# EAGLE design lt308x_test_board-v0001 (EAGLE 6.4)
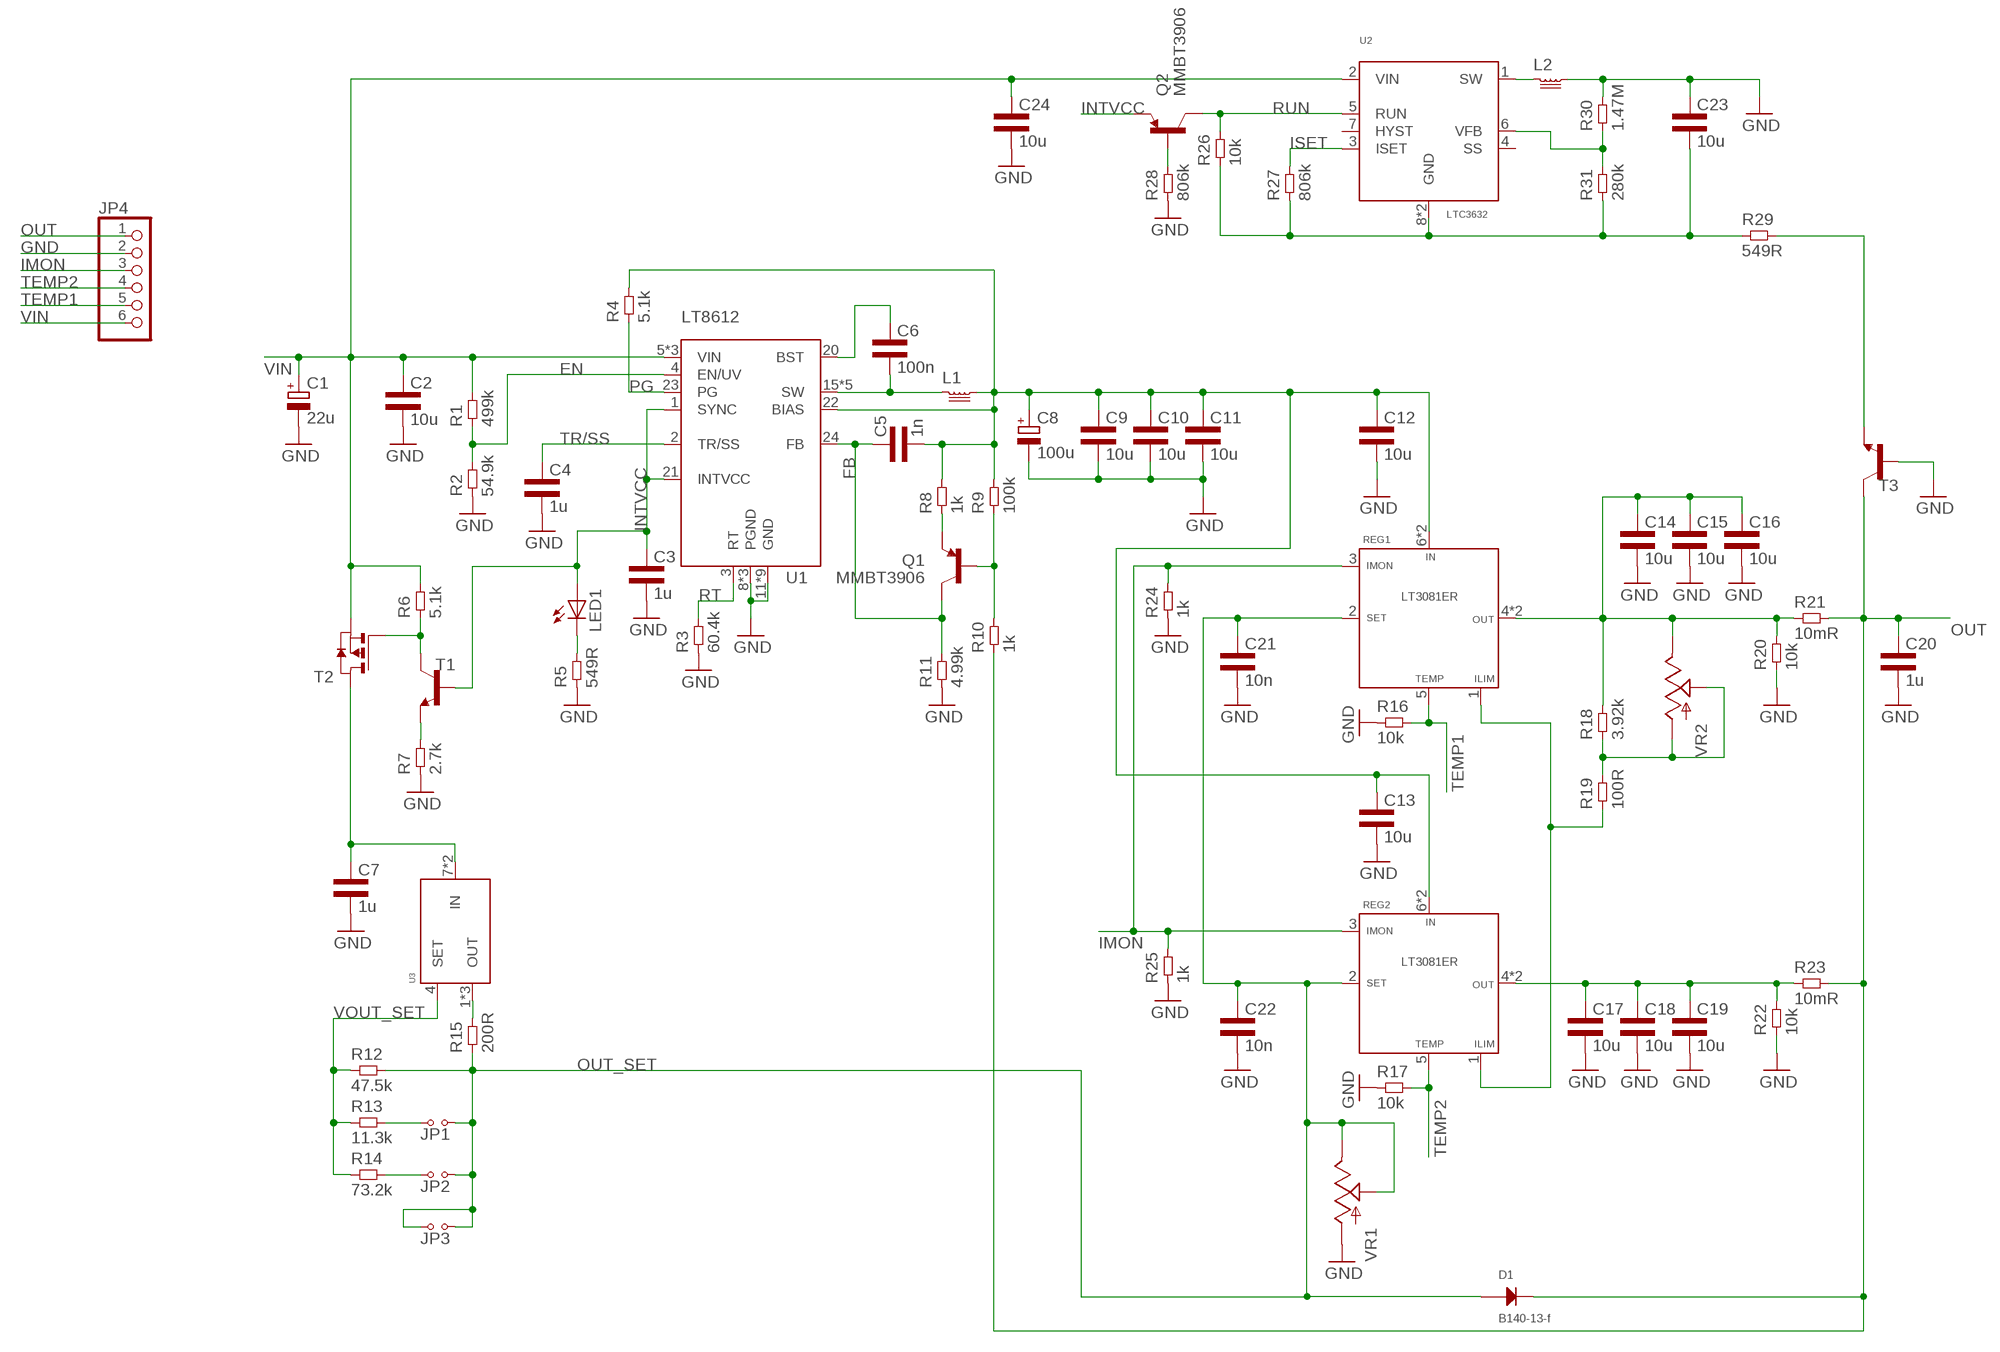
[diagram p0: schematic, sheet 1]

## Parts
C1  22u  CPOL-EUUD-6,3X7,7  [UD-6,3X7,7_NICHICON]
C2  10u  CAP1210L3  [1210L3]
C3  1u  CAP0603L3  [0603L3]
C4  1u  CAP0603L3  [0603L3]
C5  1n  CAP0603L3  [0603L3]
C6  100n  CAP0603L3  [0603L3]
C7  1u  CAP0805L3  [0805L3]
C8  100u  CPOL-EUUD-6,3X7,7  [UD-6,3X7,7_NICHICON]
C9  10u  CAP1210L3  [1210L3]
C10  10u  CAP1210L3  [1210L3]
C11  10u  CAP1210L3  [1210L3]
C12  10u  CAP1210L3  [1210L3]
C13  10u  CAP1210L3  [1210L3]
C14  10u  CAP1210L3  [1210L3]
C15  10u  CAP1210L3  [1210L3]
C16  10u  CAP1210L3  [1210L3]
C17  10u  CAP1210L3  [1210L3]
C18  10u  CAP1210L3  [1210L3]
C19  10u  CAP1210L3  [1210L3]
C20  1u  CAP1206L3  [1206L3]
C21  10n  CAP0603L3  [0603L3]
C22  10n  CAP0603L3  [0603L3]
C23  10u  CAP0805L3  [0805L3]
C24  10u  CAP0805L3  [0805L3]
D1  B140-13-f  DIODESMA  [SMA-2]
JP1  JUMPER2  [JUMPER2]
JP2  JUMPER2  [JUMPER2]
JP3  JUMPER2  [JUMPER2]
JP4  PINHD-1X6  [1X06]
L1  INDUCTOR10.5X10.5  [10.5X10.5]
L2  INDUCTOR1210L1  [1210L1]
LED1  LEDCHIPLED_0805  [CHIPLED_0805]
Q1  MMBT3906  TRANSISTOR_PNPMMBT3906  [SOT23]
Q2  MMBT3906  TRANSISTOR_PNPMMBT3906  [SOT23]
R1  499k  RES0603L3  [0603L3]
R2  54.9k  RES0603L3  [0603L3]
R3  60.4k  RES0603L3  [0603L3]
R4  5.1k  RES0603L3  [0603L3]
R5  549R  RES0603L3  [0603L3]
R6  5.1k  RES0603L3  [0603L3]
R7  2.7k  RES0603L3  [0603L3]
R8  1k  RES0603L3  [0603L3]
R9  100k  RES0603L3  [0603L3]
R10  1k  RES0603L3  [0603L3]
R11  4.99k  RES0603L3  [0603L3]
R12  47.5k  RES0603L3  [0603L3]
R13  11.3k  RES0603L3  [0603L3]
R14  73.2k  RES0603L3  [0603L3]
R15  200R  RES0805L3  [0805L3]
R16  10k  RES0603L3  [0603L3]
R17  10k  RES0603L3  [0603L3]
R18  3.92k  RES0603L3  [0603L3]
R19  100R  RES0603L3  [0603L3]
R20  10k  RES1210L3  [1210L3]
R21  10mR  RES1210L3  [1210L3]
R22  10k  RES1210L3  [1210L3]
R23  10mR  RES1210L3  [1210L3]
R24  1k  RES0603L3  [0603L3]
R25  1k  RES0603L3  [0603L3]
R26  10k  RES0603L3  [0603L3]
R27  806k  RES0603L3  [0603L3]
R28  806k  RES0603L3  [0603L3]
R29  549R  RES0603L3  [0603L3]
R30  1.47M  RES0603L3  [0603L3]
R31  280k  RES0603L3  [0603L3]
REG1  LT3081ER  [DPAK-7]
REG2  LT3081ER  [DPAK-7]
T1  TRANSISTOR_MMBT3904LT1-NPN-SOT23-BEC  [TRANSISTOR_SOT23-BEC]
T2  PMOSSOT23  [SOT-23]
T3  TRANSISTOR_MMBT3904LT1-NPN-SOT23-BEC  [TRANSISTOR_SOT23-BEC]
U1  LT8612  [UDE-3X6]
U2  LTC3632  [DFN-3X3]
U3  LT3092  [DD-8]
VR1  POT  [ALPS_POT]
VR2  POT  [ALPS_POT]

## Nets
-5V: C23.2 R26.P$1 R27.P$1 R29.P$1 R31.P$1 U2.8(GND) U2.TP(GND)
EN: R1.P$1 R2.P$2 U1.4(EN/UV)
FB: C5.P$1 Q1.3(C) R11.P$2 U1.24(FB)
FB_NEG: R30.P$1 R31.P$2 U2.6(VFB)
GND: C1.- C2.P$2 C3.P$2 C4.P$2 C7.2 C8.- C9.P$2 C10.P$2 C11.P$2 C12.P$2 C13.P$2 C14.P$2 C15.P$2 C16.P$2 C17.P$2 C18.P$2 C19.P$2 C20.2 C21.P$2 C22.P$2 C23.1 C24.2 JP4.2 L2.2 R2.P$1 R3.P$1 R5.P$1 R7.P$1 R11.P$1 R16.P$1 R17.P$1 R20.P$1 R22.P$1 R24.P$1 R25.P$1 R28.P$1 R30.P$2 T3.B U1.8(PGND) U1.9(PGND) U1.10(PGND) U1.11(GND) U1.12(GND) U1.13(GND) U1.14(GND) U1.25(GND) U1.26(GND) U1.27(GND) U1.28(GND) U1.TP(GND) VR1.P$3(A)
ILIM: R19.P$1 REG1.1(ILIM) REG2.1(ILIM)
IMON: JP4.3 R24.P$2 R25.P$2 REG1.3(IMON) REG2.3(IMON)
INTVCC: C3.P$1 LED1.A Q2.2(E) T1.B U1.1(SYNC) U1.21(INTVCC)
ISET: R27.P$2 U2.3(ISET)
LED: LED1.C R5.P$2
N$1: C7.1 T2.1(D) U3.7(IN) U3.8(IN)
N$2: R15.2 U3.1(OUT) U3.2(OUT) U3.9(OUT)
N$3: C6.P$1 U1.20(BST)
N$7: JP1.1 R13.P$2
N$8: JP2.1 R14.P$2
N$9: C5.P$2 C8.+ C9.P$1 C10.P$1 C11.P$1 C12.P$1 C13.P$1 L1.2 R4.P$2 R8.P$2 R9.P$2 REG1.6(IN) REG1.7(IN) REG2.6(IN) REG2.7(IN) U1.22(BIAS)
N$11: Q1.2(E) R8.P$1
N$12: R6.P$1 T1.C T2.3(G)
N$13: R7.P$2 T1.E
N$17: R18.P$1 R19.P$2 VR2.P$2(S) VR2.P$3(A)
N$18: C14.P$1 C15.P$1 C16.P$1 R18.P$2 R20.P$2 R21.P$1 REG1.4(OUT) REG1.TAB(OUT) VR2.P$1(E)
N$23: R29.P$2 T3.E
N$24: C17.P$1 C18.P$1 C19.P$1 R22.P$2 R23.P$1 REG2.4(OUT) REG2.TAB(OUT)
OUT: C20.1 D1.2(CATHODE) JP4.1 R10.P$1 R21.P$2 R23.P$2 T3.C
OUT_SET: C21.P$1 C22.P$1 D1.1(ANODE) JP1.2 JP2.2 JP3.1 JP3.2 R12.P$2 R15.1 REG1.2(SET) REG2.2(SET) VR1.P$1(E) VR1.P$2(S)
PG: R4.P$1 U1.23(PG)
Q1_GATE: Q1.1(B) R9.P$1 R10.P$2
Q2_GATE: Q2.1(B) R28.P$2
RT: R3.P$2 U1.3(RT)
RUN: Q2.3(C) R26.P$2 U2.5(RUN)
SW_BOOST: C6.P$2 L1.1 U1.15(SW) U1.16(SW) U1.17(SW) U1.18(SW) U1.19(SW)
SW_NEG: L2.1 U2.1(SW)
TEMP1: JP4.5 R16.P$2 REG1.5(TEMP)
TEMP2: JP4.4 R17.P$2 REG2.5(TEMP)
TR/SS: C4.P$1 U1.2(TR/SS)
VIN: C1.+ C2.P$1 C24.1 JP4.6 R1.P$2 R6.P$2 T2.2(S) U1.5(VIN) U1.6(VIN) U1.7(VIN) U2.2(VIN)
VOUT_SET: R12.P$1 R13.P$1 R14.P$1 U3.4(SET)
Unconnected: U2.4(SS) U2.7(HYST)

## Library data of the parts
C1 C8 = rcl:CPOL-EU: POLARIZED CAPACITOR, European symbol
C2-C7 C9-C24 = common:CAP
D1 = common:DIODE
JP1-JP3 = common:JUMPER2
JP4 = adafruit:PINHD-1X6: PIN HEADER
L1 L2 = common:INDUCTOR
LED1 = adafruit:LED: LED OSRAM: - CHIPLED LG R971, LG N971, LY N971, LG Q971, LY Q971, LO R971, LY R971 LH N974, LH R974 LS Q976, LO Q976, LY Q976 LO Q996 - Hyper CHIPLED LW Q18S LB Q993, LB Q99A, LB R99A - SideLED LS A670, LO A670, LY A670, LG A670, LP A670 LB A673, LV A673, LT A673, LW A673 LH A674 LY A675 LS A676, LA A676, LO A676, LY A676, LW A676 LS A679, LY A679, LG A679 - Hyper Micro SIDELED® LS Y876, LA Y876, LO Y876, LY Y876 LT Y87S - SmartLED LW L88C, LW L88S LB L89C, LB L89S, LG L890 LS L89K, LO L89K, LY L89K LS L896, LA L896, LO L896, LY L896 - TOPLED LS T670, LO T670, LY T670, LG T670, LP T670 LSG T670, LSP T670, LSY T670, LOP T670, LYG T670 LG T671, LOG T671, LSG T671 LB T673, LV T673, LT T673, LW T673 LH T674 LS T676, LA T676, LO T676, LY T676, LB T676, LH T676, LSB T676, LW T676 LB T67C, LV T67C, LT T67C, LS T67K, LO T67K, LY T67K, LW E67C LS E67B, LA E67B, LO E67B, LY E67B, LB E67C, LV E67C, LT E67C LW T67C LS T679, LY T679, LG T679 LS T770, LO T770, LY T770, LG T770, LP T770 LB T773, LV T773, LT T773, LW T773 LH T774 LS E675, LA E675, LY E675, LS T675 LS T776, LA T776, LO T776, LY T776, LB T776 LHGB T686 LT T68C, LB T68C - Hyper Mini TOPLED® LB M676 - Mini TOPLED Santana® LG M470 LS M47K, LO M47K, LY M47K Source: http://www.osram.convergy.de/
Q1 Q2 = SparkFun-DiscreteSemi:TRANSISTOR_PNP: Generic PNP BJT Double check pinouts against datasheets- not all devices are the same! MMBT3906 - 40V 200mA SOT-23 (TRANS-08052) MMBT4403 - 40V 600mA SOT-23 (TRANS-09245); PROD_ID: TRANS-08052
R1-R31 = common:RES
REG1 REG2 = common:LT3081ER
T1 T3 = logic:TRANSISTOR_*-NPN-: NPN Transistror BF959 corrected 2008.03.06
T2 = zetex:PMOSSOT23: MOS FET; OC_FARNELL: unknown; OC_NEWARK: unknown
U1 = common:LT8612
U2 = common:LTC3632
U3 = common:LT3092
VR1 VR2 = SparkFun-Electromechanical:POT

## Board
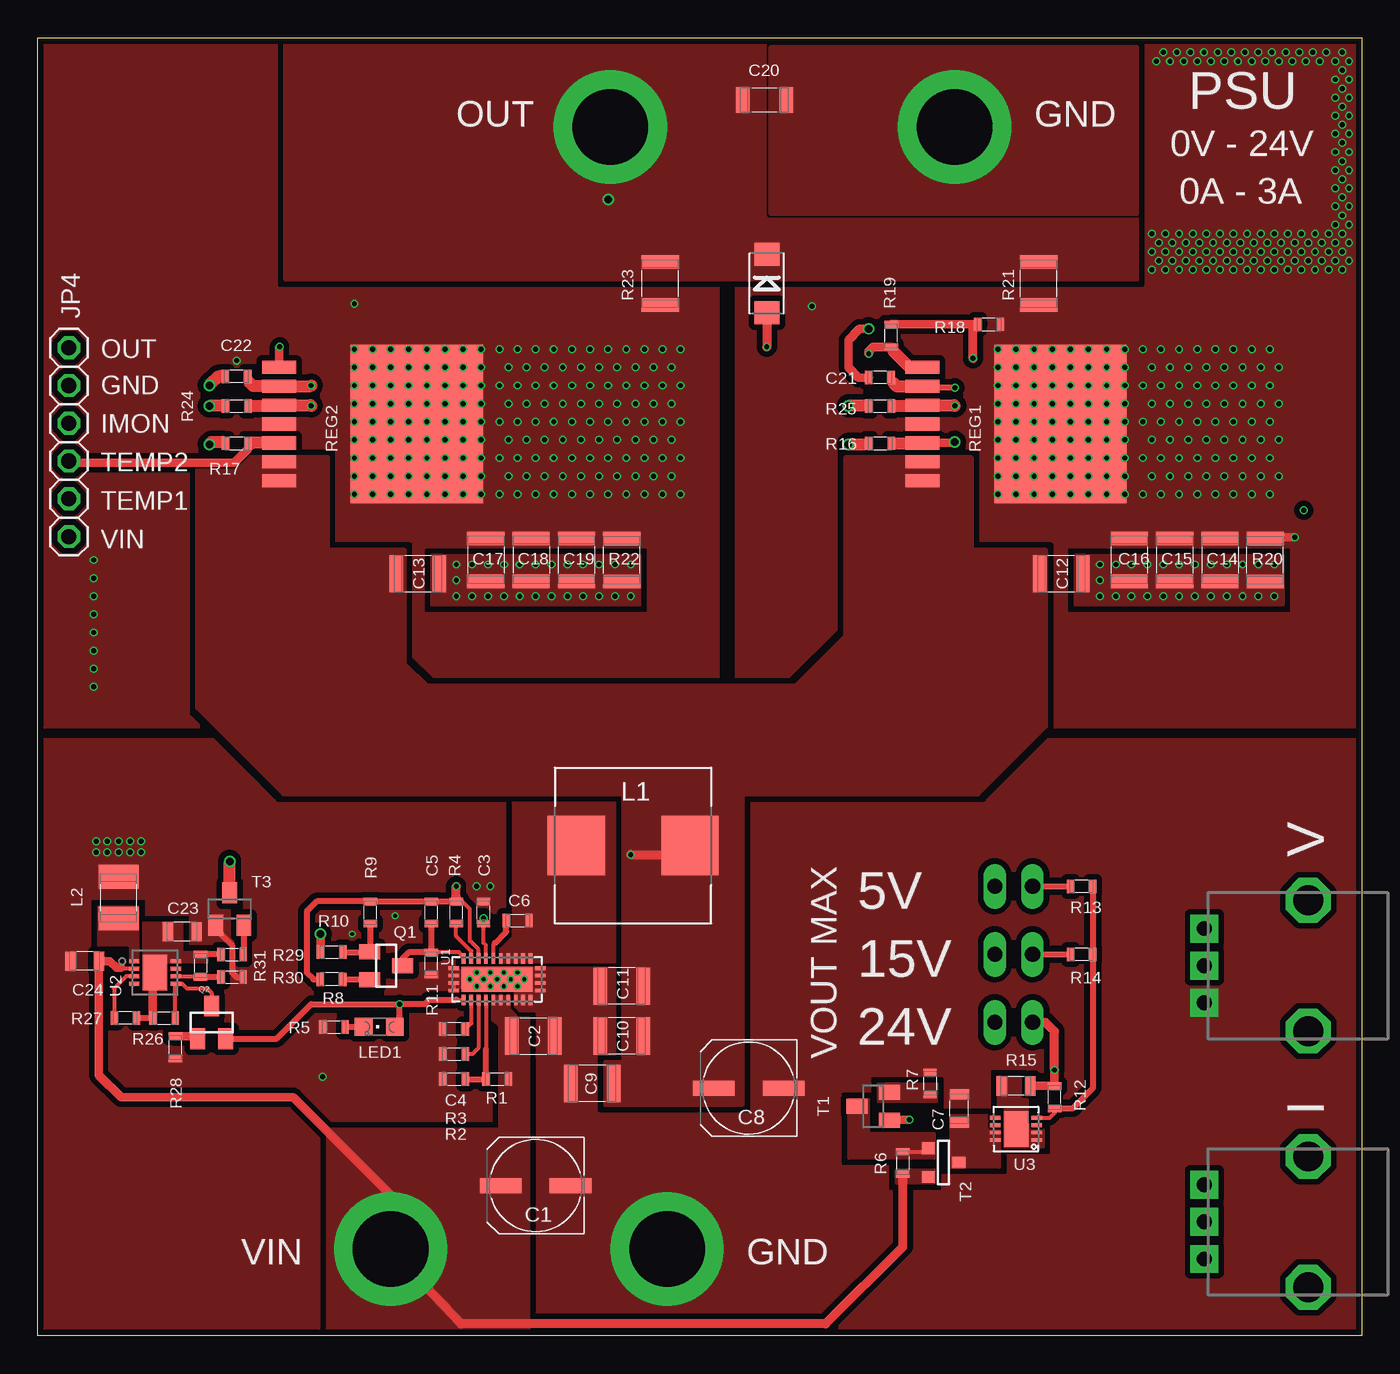
[diagram p1: board, top side]
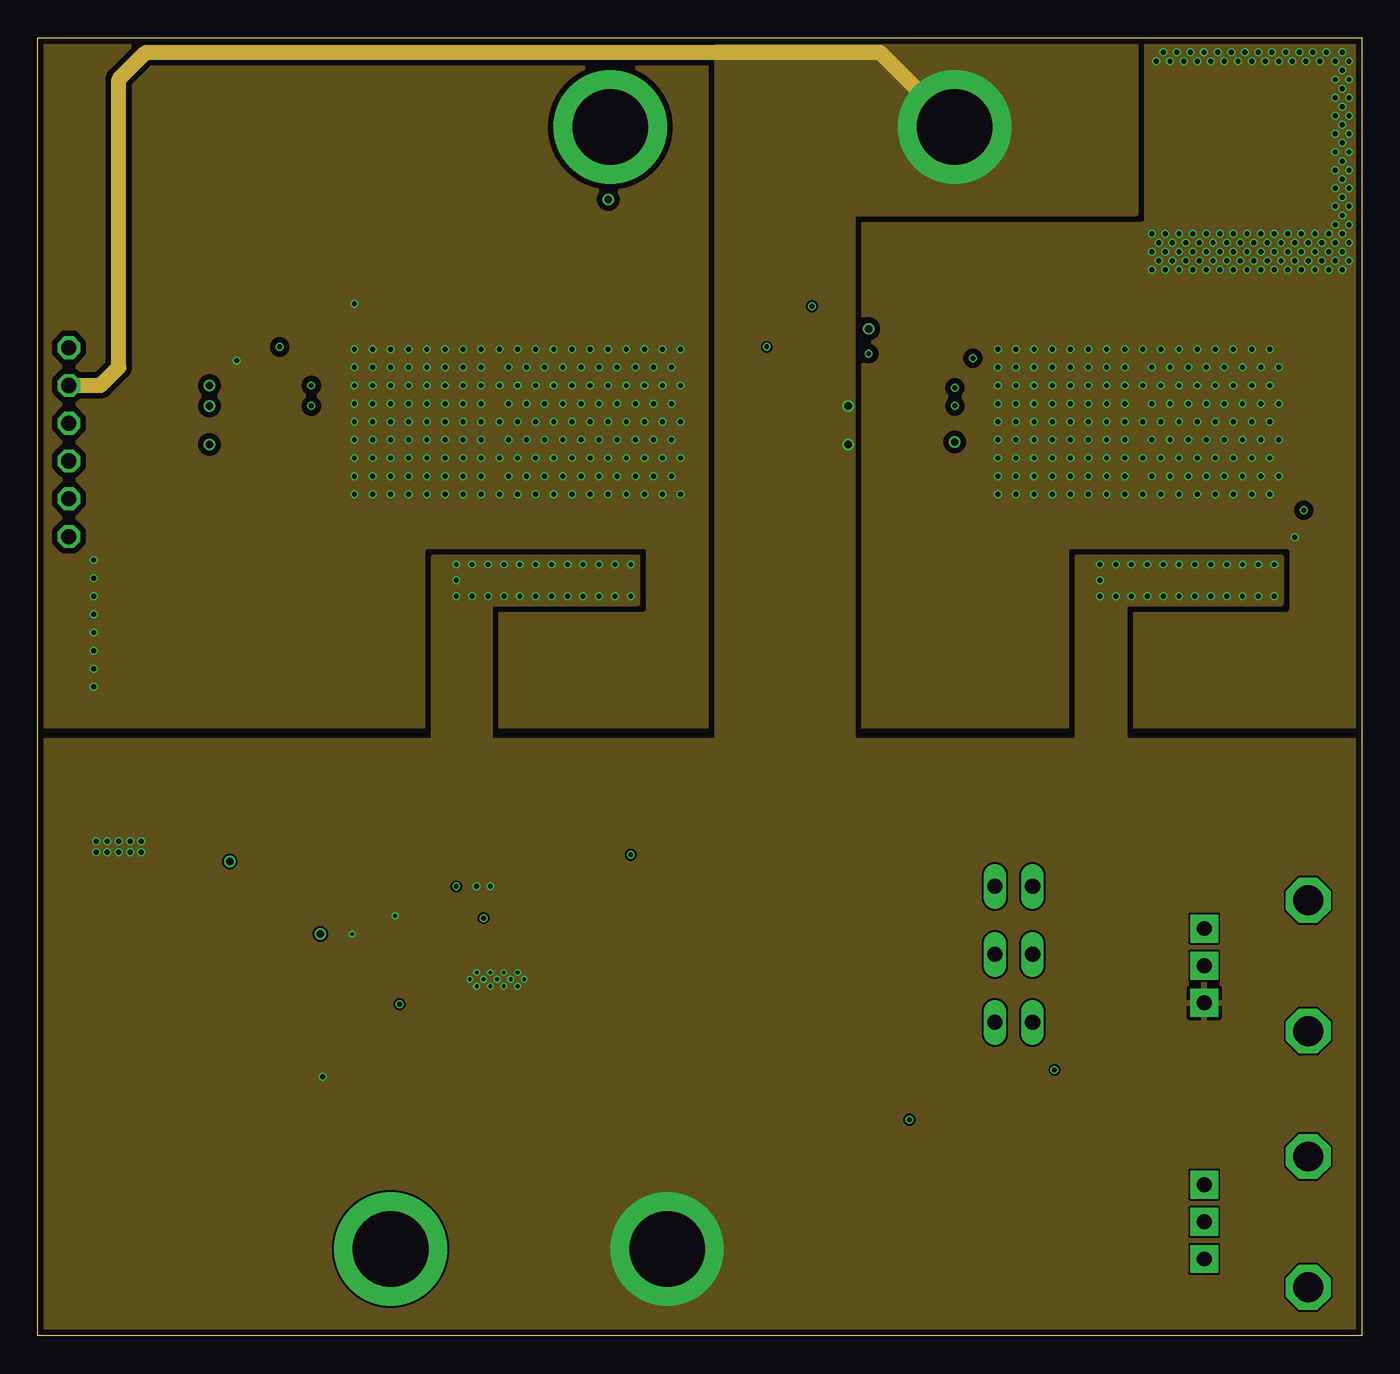
[diagram p2: board, inner layer Route2]
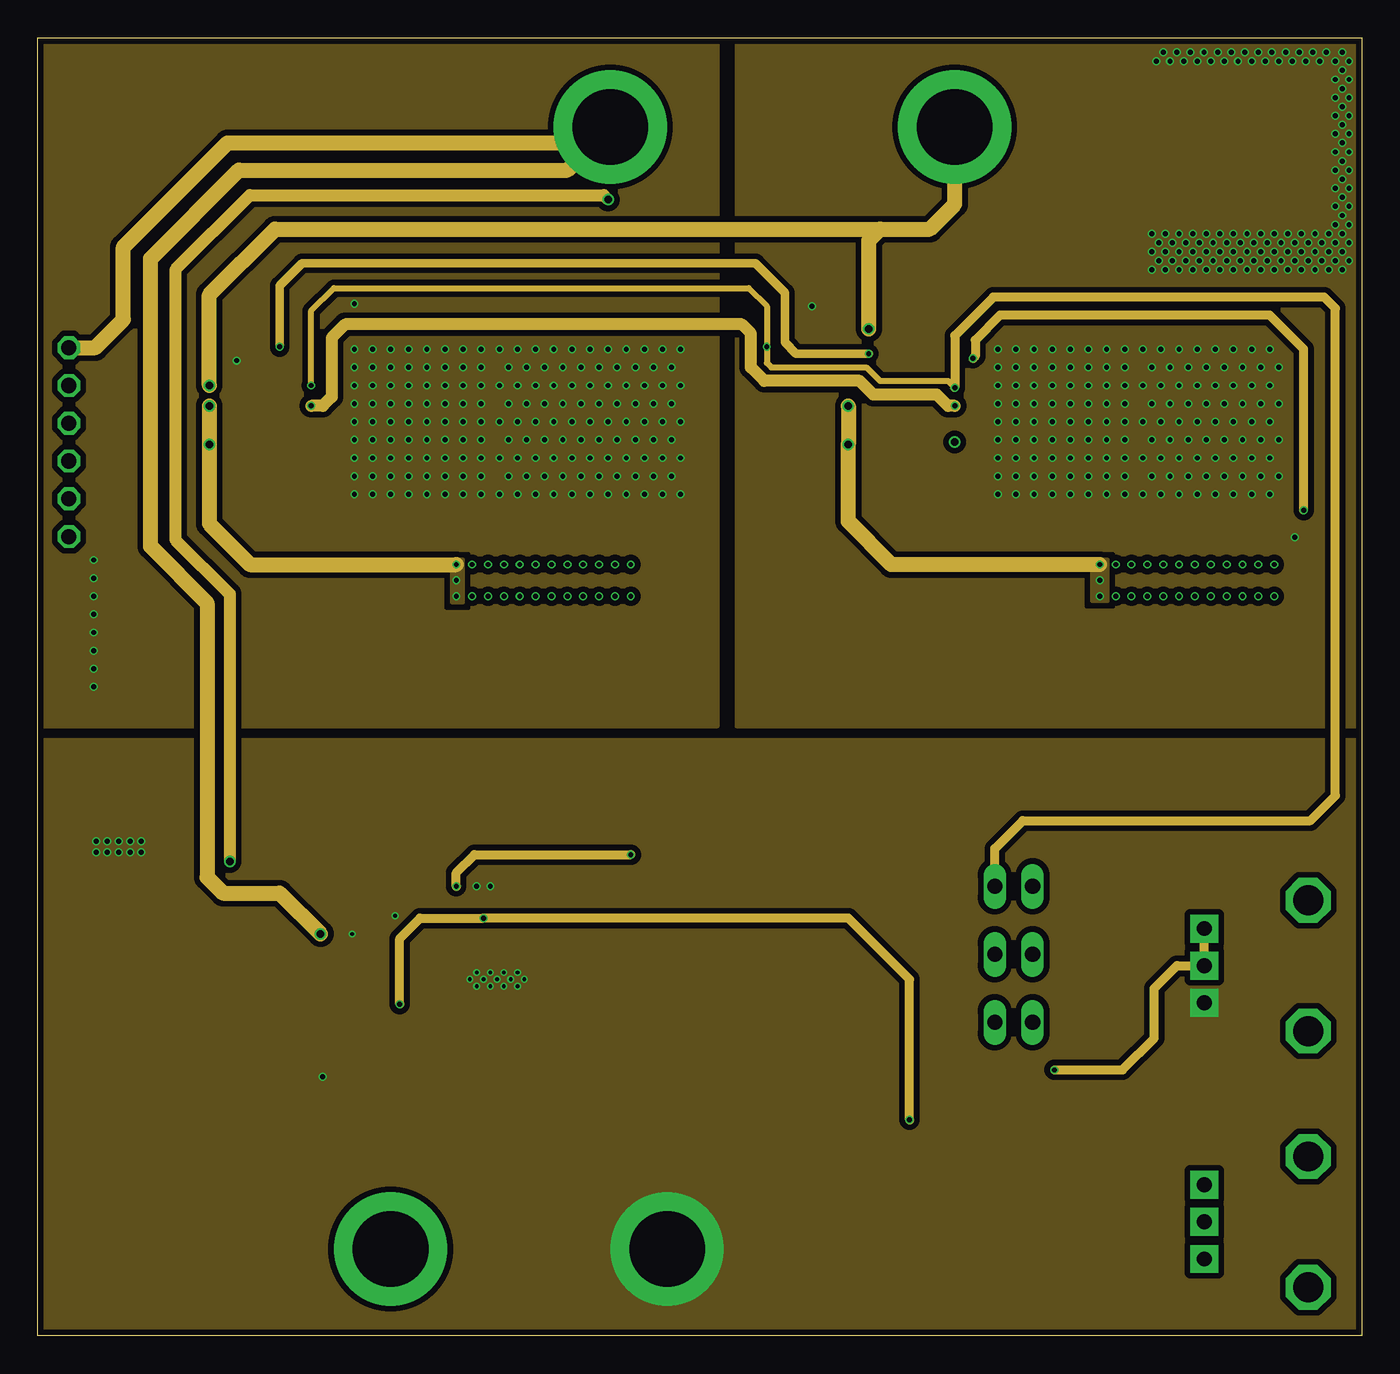
[diagram p3: board, inner layer Route3]
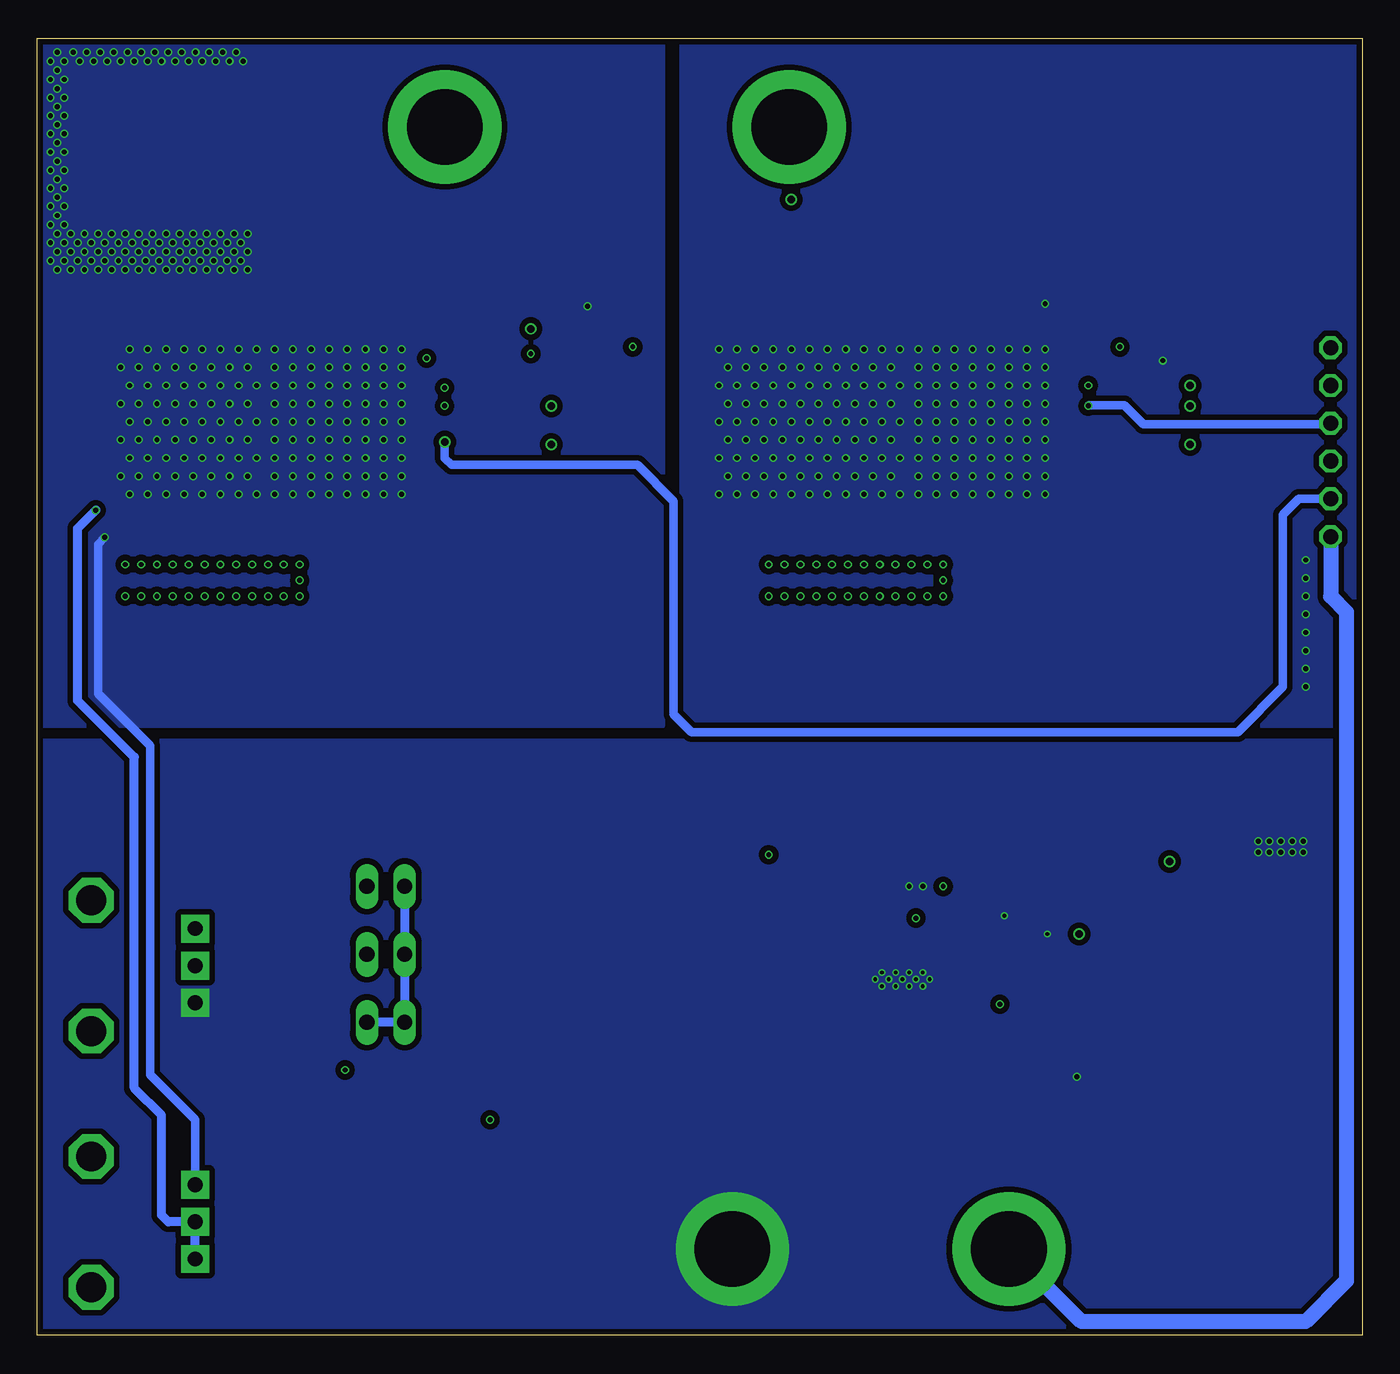
[diagram p4: board, bottom side, seen from below]

Size 89.13 x 87.2 mm. Coordinates in mm from the lower left corner, seen from the top.
Outline: 0,0 89.13,0 89.13,87.2 0,87.2 0,0
Copper layers (1*2*3*16): Top 0.035mm / dielectric 1.5mm / Route2 0.035mm / dielectric 0.15mm / Route3 0.035mm / dielectric 0.2mm / Bottom 0.035mm
Design rules "default *": minimum track width 5mil, minimum drill 10mil, track to track 5mil, track to pad 5mil, pad to pad 5mil, via to via 5mil, smd to smd 5mil, copper to edge 16mil, drill to drill 6mil, minimum pad ring 4mil, minimum via ring 4mil, stop-mask expansion 4mil, vias tented up to drill 21mil, thermal gap 10mil

### Footprints (pad centres in the part's own frame; a part is rotated, then mirrored left to right if it is on the bottom)
UD-6,3X7,7_NICHICON = smd 2.8 x 1: + 2.35,0; - -2.35,0
1210L3 = smd 0.9 x 2.5: P$1 -1.45,0; P$2 1.45,0
0603L3 = smd 0.5 x 0.9: P$1 -0.75,0; P$2 0.75,0
0805L3 = smd 0.7 x 1.3: 1 -0.95,0; 2 0.95,0
1206L3 = smd 0.9 x 1.7: 1 -1.45,0; 2 1.45,0
SMA-2 = smd 1.52 x 1.68: 1 -1.965,0; 2 1.965,0
JUMPER2 = drill 1.016 long: 1 -1.27,0; 2 1.27,0
1X06 = drill 1.016 octagon: 1 -6.35,0; 2 -3.81,0; 3 -1.27,0; 4 1.27,0; 5 3.81,0; 6 6.35,0
10.5X10.5 = smd 3.85 x 4: 1 -3.825,0; 2 3.825,0
1210L1 = smd 1.6 x 2.7: 1 -1.4,0; 2 1.4,0
CHIPLED_0805 = smd 1.2 x 1.2: A 0,-1.05; C 0,1.05
SOT23 = smd 1 x 1.4: 1 -0.95,-1.1; 2 0.95,-1.1; 3 0,1.1
DPAK-7 = smd 0.889 x 2.286: 1 -3.81,-6.287; 2 -2.54,-6.287; 3 -1.27,-6.287; 4 0,-6.287; 5 1.27,-6.287; 6 2.54,-6.287; 7 3.81,-6.287 | smd 10.668 x 8.89: TAB 0,2.985
TRANSISTOR_SOT23-BEC = smd 1 x 1.4: B -0.95,-1.1; C 0,1.1; E 0.95,-1.1
SOT-23 = smd 0.787 x 0.889: 1 0.025,-1.016; 2 -0.94,1.016; 3 0.991,1.016
UDE-3X6 = smd 0.25 x 0.7: 1 -2.25,-1.4; 2 -1.75,-1.4; 3 -1.25,-1.4; 4 -0.75,-1.4; 5 -0.25,-1.4; 6 0.25,-1.4; 7 0.75,-1.4; 8 1.25,-1.4; 9 1.75,-1.4; 10 2.25,-1.4; 15 2.25,1.4; 16 1.75,1.4; 17 1.25,1.4; 18 0.75,1.4; 19 0.25,1.4; 20 -0.25,1.4; 21 -0.75,1.4; 22 -1.25,1.4; 23 -1.75,1.4; 24 -2.25,1.4 | smd 0.7 x 0.25: 11 2.9,-0.75; 12 2.9,-0.25; 13 2.9,0.25; 14 2.9,0.75; 25 -2.9,0.75; 26 -2.9,0.25; 27 -2.9,-0.25; 28 -2.9,-0.75 | smd 4.75 x 1.7: TP 0,0
DFN-3X3 = smd 0.25 x 0.7: 1 -0.75,-1.4; 2 -0.25,-1.4; 3 0.25,-1.4; 4 0.75,-1.4; 5 0.75,1.4; 6 0.25,1.4; 7 -0.25,1.4; 8 -0.75,1.4 | smd 2.38 x 1.65: TP 0,0
DD-8 = smd 0.25 x 0.7: 1 -0.75,-1.4; 2 -0.25,-1.4; 3 0.25,-1.4; 4 0.75,-1.4; 5 0.75,1.4; 6 0.25,1.4; 7 -0.25,1.4; 8 -0.75,1.4 | smd 2.38 x 1.65: 9 0,0
ALPS_POT = drill 1 pad 1.88 square: P$1 7,-2.5; P$2 7,0; P$3 7,2.5 | drill 2 octagon: P$4 0,-4.4; P$5 0,4.4

### Placement (x,y rotation side)
C1  33.53,10.06 180 top
C2  33.38,20.12 0 top
C3  30.02,28.42 90 top
C4  28.04,20.57 180 top
C5  26.52,28.42 90 top
C6  32.31,27.89 0 top
C7  62.03,15.24 90 top
C8  47.85,16.61 180 top
C9  37.34,16.92 180 top
C10  39.32,20.12 180 top
C11  39.32,23.47 180 top
C12  68.88,51.21 0 top
C13  25.6,51.21 0 top
C14  79.55,52.12 270 top
C15  76.5,52.12 270 top
C16  73.46,52.12 270 top
C17  30.18,52.12 270 top
C18  33.22,52.12 270 top
C19  36.27,52.12 270 top
C20  48.92,83.06 0 top
C21  56.69,64.39 180 top
C22  13.41,64.47 180 top
C23  9.75,27.13 180 top
C24  3.2,25.15 180 top
D1  49.07,70.71 90 top
JP1  65.68,30.18 180 top
JP2  65.68,25.6 180 top
JP3  65.68,21.03 180 top
JP4  2.13,60.05 270 top
L1  40.08,32.92 0 top
L2  5.49,29.41 90 top
LED1  23.01,20.73 90 top
Q1  23.47,24.84 270 top
Q2  11.73,21.03 0 top
R1  30.94,17.22 0 top
R2  28.04,17.22 0 top
R3  28.04,18.9 0 top
R4  28.19,28.42 90 top
R5  19.96,20.73 0 top
R6  58.22,11.58 270 top
R7  60.05,16.92 270 top
R8  19.81,23.93 180 top
R9  22.4,28.42 90 top
R10  19.81,25.76 0 top
R11  26.52,24.99 90 top
R12  68.43,16 90 top
R13  70.26,30.18 180 top
R14  70.26,25.6 180 top
R15  65.84,16.76 180 top
R16  56.69,59.97 0 top
R17  13.41,59.97 0 top
R18  64.01,67.97 0 top
R19  57.45,67.21 90 top
R20  82.6,52.12 90 top
R21  67.36,70.71 90 top
R22  39.32,52.12 90 top
R23  41.91,70.71 90 top
R24  13.41,62.48 0 top
R25  56.69,62.48 0 top
R26  8.53,21.34 0 top
R27  5.94,21.34 180 top
R28  9.3,19.35 90 top
R29  13.11,25.6 0 top
R30  13.11,24.08 0 top
R31  10.97,24.84 270 top
REG1  65.84,61.26 270 top
REG2  22.56,61.26 270 top
T1  56.24,15.39 90 top
T2  60.96,11.58 90 top
T3  12.95,28.65 0 top
U1  30.94,23.93 0 top
U2  7.92,24.38 270 top
U3  65.84,13.87 90 top
VR1  85.5,24.84 180 top
VR2  85.5,7.62 180 top

### Tracks (layer width: path | path; a pad name or v marks a point on that pad's centre or on a via)
-5V
  Top 0.406: R29.P$1 10.98,25.6 R31.P$1 | R27.P$1 R26.P$1
  Top 0.559: R26.P$1 7.78,24.24 U2.TP
  pour Top (no thermals): 7.16,23.24 7.16,27.74 9.75,27.74 9.75,25.76 11.43,25.76 11.43,25.07 8.69,25.07 8.69,23.24
EN
  Top 0.254: U1.4 30.19,19.21 30.17,19.2
  Top 0.406: R2.P$2 R1.P$1 30.17,17.23 30.17,19.2
FB
  Top 0.254: U1.24 28.69,25.41 28.35,25.76 R11.P$2
  Top 0.406: C5.P$1 R11.P$2 24.98,25.74 24.57,25.33 Q1.3
FB_NEG
  Top 0.254: U2.6 10.93,24.13 R31.P$2
  Top 0.406: R30.P$1 10.98,24.08 R31.P$2
GND  (via drill 0.25, 0.33, 0.51, 5.08 pad 7.62)
  Top 0.254: U1.28 U1.27
  Top 0.406: T3.B 12,27.32 13.11,26.21 13.11,24.38 13.41,24.08 R30.P$2 | R17.P$1 12.57,59.97 12.5,60.05 | R24.P$1 12.5,62.48 | C22.P$2 12.5,64.47 | 55.63,59.89 55.87,59.89 R16.P$1 | R25.P$1 55.78,62.48
  Top 0.559: v55.93,67.67 55.32,67.67 54.56,66.9 54.56,65.07 55.25,64.39 C21.P$2
  Top 0.813: 12.5,60.05 11.73,60.05 v11.58,59.89 | 12.5,62.48 v11.58,62.48 | v54.56,59.89 55.63,59.89 | 55.78,62.48 v54.56,62.48 | 12.5,64.47 12.19,64.47 v11.58,63.86
  Route2 1.016: 61.87,81.08 56.69,86.26 7.31,86.26 5.49,84.43 5.49,65.07 4.27,63.86 JP4.2
  Route3 1.016: v11.58,63.86 11.58,69.95 16,74.37 56.69,74.37 | 56.69,74.37 60.05,74.37 61.72,76.05 v61.72,81.23 | v28.19,51.82 14.33,51.82 11.58,54.56 v11.58,59.89 v11.58,62.48 | v55.93,67.67 55.93,73.61 56.69,74.37 | v71.48,51.82 57.45,51.82 54.56,54.71 v54.56,59.89 v54.56,62.48
  other vias: 28.19,50.75 28.19,49.68 29.26,49.68 30.33,49.68 31.39,49.68 32.46,49.68 33.53,49.68 34.59,49.68 35.66,49.68 36.73,49.68 37.8,49.68 38.86,49.68 39.93,49.68 42.37,5.79 71.48,50.75 71.48,49.68 72.54,49.68 73.61,49.68 74.68,49.68 75.74,49.68 76.81,49.68 77.88,49.68 78.94,49.68 80.01,49.68 81.08,49.68 82.14,49.68 83.21,49.68 29.26,51.82 30.33,51.82 31.39,51.82 32.46,51.82 33.53,51.82 34.59,51.82 35.66,51.82 36.73,51.82 37.8,51.82 38.86,51.82 39.93,51.82 72.54,51.82 73.61,51.82 74.68,51.82 75.74,51.82 76.81,51.82 77.88,51.82 78.94,51.82 80.01,51.82 81.08,51.82 82.14,51.82 83.21,51.82 5.49,32.46 4.72,32.46 3.96,32.46 6.25,32.46 7.01,32.46 3.96,33.22 4.72,33.22 5.49,33.22 6.25,33.22 7.01,33.22 29.57,30.18 30.48,30.18 19.2,17.37 30.94,23.93 29.11,23.93 29.57,24.38 29.57,23.47 30.02,23.93 30.48,24.38 30.48,23.47 31.39,24.38 31.39,23.47 31.85,23.93 32.31,24.38 32.31,23.47 32.77,23.93 24.08,28.19 21.18,26.97
  pour Top (no thermals): 28.65,24.69 38.86,24.69 38.86,18.9 36.88,18.9 36.88,15.7 37.19,15.39 37.19,9.6 34.44,9.6 34.44,21.79 32.46,21.79 32.16,22.1 32.16,23.16 28.65,23.16
  pour Top (no thermals): 69.8,52.43 83.82,52.43 83.82,49.07 69.8,49.07
  pour Top (no thermals): 26.52,52.43 40.54,52.43 40.54,49.07 26.52,49.07
  pour Top (isolate 0.381, rank 6, no thermals): 0.15,0.15 89,0.15 89,39.93 0.15,39.93
  pour Top (isolate 0.381, no thermals): 73.91,86.56 73.91,75.44 49.38,75.44 49.38,86.56
  pour Route2: 0.3,0.15 88.85,0.15 88.85,39.93 73.15,39.93 73.15,49.23 83.67,49.23 83.67,52.27 69.95,52.27 69.95,39.93 54.86,39.93 54.86,75.44 73.91,75.44 73.91,87.02 45.72,87.02 45.72,39.93 30.48,39.93 30.48,49.23 40.39,49.23 40.39,52.27 26.67,52.27 26.67,39.93 0.3,39.93
  pour Route3 (isolate 0.381, rank 6, no thermals): 0.15,0.15 89,0.15 89,39.93 0.15,39.93
  pour Bottom (isolate 0.381, rank 6, no thermals): 0.15,0.15 89,0.15 89,39.93 0.15,39.93
  pour Route3: 27.89,52.2 28.65,52.2 28.65,49.23 27.89,49.23
  pour Route3: 71.09,52.2 71.93,52.2 72.01,52.2 72.01,49.3 70.94,49.3 70.94,52.2
ILIM  (via drill 0.33)
  Top 0.406: 57.61,66.14 57.61,66.31 R19.P$1
  Top 0.559: REG2.1 16.27,66.41 v16.31,66.45
  Top 0.61: 59.54,65.09 REG1.1 | v55.93,65.99 55.93,66.14 56.24,66.45 57.44,66.45 R19.P$1
  Top 0.813: 59.54,65.09 58.66,65.09 57.61,66.14
  Route3 0.559: v55.93,65.99 51.05,65.99 50.29,66.75 50.29,70.1 48.31,72.09 17.83,72.09 16.31,70.56 v16.31,66.45
IMON  (via drill 0.33)
  Top 0.406: 14.33,62.48 R24.P$2 | R25.P$2 57.61,62.48
  Top 0.813: v61.72,62.48 61.67,62.53 REG1.3 59.5,62.48 57.61,62.48 | v18.44,62.48 18.39,62.53 REG2.3 16.22,62.48 14.33,62.48
  Route3 0.813: v61.72,62.48 61.27,62.48 60.5,63.25 56.24,63.25 55.32,64.16 48.92,64.16 48.01,65.07 48.01,67.36 47.4,67.97 20.73,67.97 19.81,67.06 19.81,63.09 19.2,62.48 v18.44,62.48
  Bottom 0.559: v18.44,62.48 18.39,62.53 16,62.53 14.73,61.26 2.18,61.26 JP4.3
INTVCC  (via drill 0.33)
  Top 0.254: U1.21 30.19,26.2 30.02,26.37 C3.P$1 | 28.19,22.56 28.66,22.56 U1.1
  Top 0.406: Q2.2 16.12,19.93 18.44,22.25 v24.38,22.25 | 28.19,22.56 26.36,22.56 26.06,22.25 v24.38,22.25 | LED1.A 24.38,20.73 v24.38,22.25
  Top 0.559: C3.P$1 v30.02,28.04 | v58.67,14.48 57.37,14.48 T1.B
  Route3 0.61: v24.38,22.25 24.38,26.67 25.76,28.04 v30.02,28.04 54.56,28.04 58.67,23.93 v58.67,14.48
ISET
  Top 0.254: U2.3 6,24.13 5.18,23.32 R27.P$2
LED
  Top 0.406: R5.P$2 LED1.C
N$1
  pour Top (no thermals): 64.77,14.78 61.42,14.78 61.42,11.28 64.77,11.28
N$2
  pour Top (no thermals): 67.67,12.65 65.07,12.65 65.07,15.39 64.62,15.39 64.62,17.37 66.14,17.37 66.14,15.85 66.6,15.85 66.6,14.17 67.67,14.17
N$3
  Top 0.254: U1.20 30.69,26.27 30.78,26.37
  Top 0.406: 30.78,26.37 31.55,27.13 31.55,27.88 C6.P$1
N$7
  Top 0.406: JP1.1 R13.P$2
N$8
  Top 0.406: JP2.1 R14.P$2
N$9  (via drill 0.33)
  Top 0.254: U1.22 29.69,25.94 29.11,26.52 29.11,28.65 28.59,29.17 R4.P$2
  Top 0.406: R8.P$2 18.59,23.93 18.14,24.38 18.14,28.5 18.81,29.17 R9.P$2 C5.P$2 R4.P$2 28.19,29.41
  Top 0.61: v39.93,32.31 43.59,32.31 44.04,32.77 44.04,32.78 L1.2 | 28.19,29.41 v28.19,30.18
  Route3 0.61: v28.19,30.18 28.19,31.09 29.41,32.31 v39.93,32.31
  pour Top (no thermals): 38.25,15.54 47.4,15.54 47.4,36.42 63.25,36.42 67.82,41 67.82,52.73 62.79,52.73 62.79,58.98 54.41,58.98 54.41,46.94 51.05,43.59 26.21,43.59 24.69,45.11 24.69,52.73 19.51,52.73 19.51,58.98 10.82,58.98 10.82,42.21 16.61,36.42 39.47,36.42 39.47,18.29 38.25,18.29
N$11
  Top 0.406: R8.P$1 22.33,23.93 Q1.2
N$12
  Top 0.254: R6.P$1 59.7,12.33 T2.3
  pour Top (no thermals): 54.56,15.85 54.56,11.89 60.35,11.89 60.35,13.56 55.93,13.56 55.93,15.85
N$13
  pour Top (no thermals): 56.54,16.92 60.5,16.92 60.5,15.7 56.54,15.7
N$17  (via drill 0.33)
  Top 0.559: R19.P$2 63.18,67.96 63.18,67.89
  Top 0.61: v62.94,65.68 62.94,67.65 63.18,67.89 R18.P$1
  Route3 0.61: v85.19,55.47 85.19,66.29 82.91,68.58 64.77,68.58 63.09,66.9 63.09,65.84 v62.94,65.68
  Bottom 0.61: VR2.P$3 VR2.P$2 80.31,7.62 80.77,8.08 80.77,14.78 82.6,16.61 82.6,38.86 86.41,42.67 86.41,54.25 v85.19,55.47
N$18  (via drill 0.33)
  Top 0.559: v84.58,53.64 82.67,53.64 R20.P$2
  Bottom 0.559: VR2.P$1 78.5,14.49 81.53,17.53 81.53,39.62 85.04,43.13 85.04,53.19 v84.58,53.64
  other vias: 64.62,66.29 65.84,66.29 67.06,66.29 68.28,66.29 69.49,66.29 70.71,66.29 71.93,66.29 73.15,66.29 64.62,65.07 65.84,65.07 67.06,65.07 68.28,65.07 69.49,65.07 70.71,65.07 71.93,65.07 73.15,65.07 64.62,63.86 64.62,62.64 64.62,61.42 64.62,60.2 64.62,58.98 64.62,57.76 64.62,56.54 65.84,63.86 67.06,63.86 68.28,63.86 69.49,63.86 70.71,63.86 71.93,63.86 73.15,63.86 65.84,62.64 67.06,62.64 68.28,62.64 69.49,62.64 70.71,62.64 71.93,62.64 73.15,62.64 65.84,61.42 67.06,61.42 68.28,61.42 69.49,61.42 70.71,61.42 71.93,61.42 73.15,61.42 65.84,60.2 67.06,60.2 68.28,60.2 69.49,60.2 70.71,60.2 71.93,60.2 73.15,60.2 65.84,58.98 67.06,58.98 68.28,58.98 69.49,58.98 70.71,58.98 71.93,58.98 73.15,58.98 65.84,57.76 67.06,57.76 68.28,57.76 69.49,57.76 70.71,57.76 71.93,57.76 73.15,57.76 65.84,56.54 67.06,56.54 68.28,56.54 69.49,56.54 70.71,56.54 71.93,56.54 73.15,56.54 83.21,71.63 52.12,69.19 74.37,66.29 74.98,65.07 75.59,66.29 76.81,66.29 78.03,66.29 79.25,66.29 80.47,66.29 81.69,66.29 82.91,66.29 76.2,65.07 77.42,65.07 78.64,65.07 79.86,65.07 81.08,65.07 82.3,65.07 83.52,65.07 74.37,63.86 75.59,63.86 76.81,63.86 78.03,63.86 79.25,63.86 80.47,63.86 81.69,63.86 82.91,63.86 74.98,62.64 76.2,62.64 77.42,62.64 78.64,62.64 79.86,62.64 81.08,62.64 82.3,62.64 83.52,62.64 74.37,61.42 75.59,61.42 76.81,61.42 78.03,61.42 79.25,61.42 80.47,61.42 81.69,61.42 82.91,61.42 74.98,60.2 76.2,60.2 77.42,60.2 78.64,60.2 79.86,60.2 81.08,60.2 82.3,60.2 83.52,60.2 74.37,58.98 75.59,58.98 76.81,58.98 78.03,58.98 79.25,58.98 80.47,58.98 81.69,58.98 82.91,58.98 74.98,57.76 76.2,57.76 77.42,57.76 78.64,57.76 79.86,57.76 81.08,57.76 82.3,57.76 83.52,57.76 74.37,56.54 75.59,56.54 76.81,56.54 78.03,56.54 79.25,56.54 80.47,56.54 81.69,56.54 82.91,56.54 84.12,71.63 85.04,71.63 85.95,71.63 86.87,71.63 87.78,71.63 82.3,71.63 81.38,71.63 80.47,71.63 79.55,71.63 78.64,71.63 77.72,71.63 76.81,71.63 75.9,71.63 74.98,71.63 75.44,72.24 76.35,72.24 77.27,72.24 78.18,72.24 79.1,72.24 80.01,72.24 80.92,72.24 81.84,72.24 82.75,72.24 83.67,72.24 84.58,72.24 85.5,72.24 86.41,72.24 87.33,72.24 75.9,72.85 74.98,72.85 76.81,72.85 77.72,72.85 78.64,72.85 79.55,72.85 80.47,72.85 81.38,72.85 82.3,72.85 83.21,72.85 84.12,72.85 85.04,72.85 85.95,72.85 86.87,72.85 87.78,72.85 75.44,73.46 76.35,73.46 77.27,73.46 78.18,73.46 79.1,73.46 80.01,73.46 80.92,73.46 81.84,73.46 82.75,73.46 83.67,73.46 84.58,73.46 85.5,73.46 86.41,73.46 87.33,73.46 75.9,74.07 76.81,74.07 74.98,74.07 77.72,74.07 78.64,74.07 79.55,74.07 80.47,74.07 81.38,74.07 82.3,74.07 83.21,74.07 84.12,74.07 85.04,74.07 85.95,74.07 86.87,74.07 87.78,74.07 87.78,75.29 87.33,74.68 87.33,75.9 87.78,76.5 87.33,77.11 87.78,77.72 87.33,78.33 87.78,78.94 87.33,79.55 87.78,80.16 87.33,80.77 87.78,81.38 87.33,81.99 87.78,82.6 87.33,83.21 87.78,83.82 87.33,84.43 87.78,85.04 87.33,85.65 87.78,86.26 86.72,86.26 86.26,85.65 85.8,86.26 85.34,85.65 84.89,86.26 84.43,85.65 83.97,86.26 83.52,85.65 83.06,86.26 82.6,85.65 82.14,86.26 81.69,85.65 81.23,86.26 80.77,85.65 80.31,86.26 79.86,85.65 79.4,86.26 78.94,85.65 78.49,86.26 78.03,85.65 77.57,86.26 77.11,85.65 76.66,86.26 76.2,85.65 75.74,86.26 75.29,85.65 88.24,85.65 88.24,84.43 88.24,83.21 88.24,81.99 88.24,80.77 88.24,79.55 88.24,78.33 88.24,77.11 88.24,75.9 88.24,74.68 88.24,73.46 88.24,72.24
  pour Top (isolate 0.381, rank 6, no thermals): 47.09,87.02 47.09,41 89,41 89,87.02
  pour Route2 (isolate 0.381, rank 6, no thermals): 47.09,87.02 47.09,41 89,41 89,87.02
  pour Route3 (isolate 0.381, rank 6, no thermals): 47.09,87.02 47.09,41 89,41 89,87.02
  pour Bottom (isolate 0.381, rank 6, no thermals): 47.09,87.02 47.09,41 89,41 89,87.02
N$23
  Top 0.406: T3.E 13.9,25.79 13.87,25.76 13.87,25.62 R29.P$2
N$24  (via drill 0.33)
  other vias: 21.34,66.29 22.56,66.29 23.77,66.29 24.99,66.29 26.21,66.29 27.43,66.29 28.65,66.29 29.87,66.29 21.34,65.07 22.56,65.07 23.77,65.07 24.99,65.07 26.21,65.07 27.43,65.07 28.65,65.07 29.87,65.07 29.87,63.86 28.65,63.86 27.43,63.86 26.21,63.86 24.99,63.86 23.77,63.86 22.56,63.86 21.34,63.86 21.34,62.64 22.56,62.64 23.77,62.64 24.99,62.64 26.21,62.64 27.43,62.64 28.65,62.64 29.87,62.64 21.34,61.42 22.56,61.42 23.77,61.42 24.99,61.42 26.21,61.42 27.43,61.42 28.65,61.42 29.87,61.42 21.34,60.2 22.56,60.2 23.77,60.2 24.99,60.2 26.21,60.2 27.43,60.2 28.65,60.2 29.87,60.2 21.34,58.98 22.56,58.98 23.77,58.98 24.99,58.98 26.21,58.98 27.43,58.98 28.65,58.98 29.87,58.98 21.34,57.76 22.56,57.76 23.77,57.76 24.99,57.76 26.21,57.76 27.43,57.76 28.65,57.76 29.87,57.76 21.34,56.54 22.56,56.54 23.77,56.54 24.99,56.54 26.21,56.54 27.43,56.54 28.65,56.54 29.87,56.54 31.09,66.29 32.31,66.29 33.53,66.29 34.75,66.29 35.97,66.29 37.19,66.29 38.4,66.29 39.62,66.29 40.84,66.29 42.06,66.29 43.28,66.29 31.09,63.86 32.31,63.86 33.53,63.86 34.75,63.86 35.97,63.86 37.19,63.86 38.4,63.86 39.62,63.86 40.84,63.86 42.06,63.86 43.28,63.86 31.7,65.07 32.92,65.07 34.14,65.07 35.36,65.07 36.58,65.07 37.8,65.07 39.01,65.07 40.23,65.07 41.45,65.07 42.67,65.07 31.7,62.64 32.92,62.64 34.14,62.64 35.36,62.64 36.58,62.64 37.8,62.64 39.01,62.64 40.23,62.64 41.45,62.64 42.67,62.64 31.09,61.42 32.31,61.42 33.53,61.42 34.75,61.42 35.97,61.42 37.19,61.42 38.4,61.42 39.62,61.42 40.84,61.42 42.06,61.42 43.28,61.42 31.7,60.2 32.92,60.2 34.14,60.2 35.36,60.2 36.58,60.2 37.8,60.2 39.01,60.2 40.23,60.2 41.45,60.2 42.67,60.2 3.81,43.59 3.81,44.81 3.81,46.02 3.81,47.24 3.81,48.46 3.81,49.68 3.81,50.9 3.81,52.12 21.34,69.34 13.41,65.53 31.09,58.98 31.09,56.54 31.7,57.76 32.31,58.98 33.53,58.98 34.75,58.98 35.97,58.98 37.19,58.98 38.4,58.98 39.62,58.98 40.84,58.98 42.06,58.98 43.28,58.98 32.92,57.76 34.14,57.76 35.36,57.76 36.58,57.76 37.8,57.76 39.01,57.76 40.23,57.76 41.45,57.76 42.67,57.76 32.31,56.54 33.53,56.54 34.75,56.54 35.97,56.54 37.19,56.54 38.4,56.54 39.62,56.54 40.84,56.54 42.06,56.54 43.28,56.54
  pour Top (isolate 0.381, rank 6, no thermals): 0.15,87.02 0.15,41 45.72,41 45.72,87.02
  pour Route2 (isolate 0.381, rank 6, no thermals): 0.15,87.02 0.15,41 45.72,41 45.72,87.02
  pour Route3 (isolate 0.381, rank 6, no thermals): 0.15,87.02 0.15,41 45.72,41 45.72,87.02
  pour Bottom (isolate 0.381, rank 6, no thermals): 0.15,87.02 0.15,41 45.72,41 45.72,87.02
OUT  (via drill 0.51, 5.08 pad 7.62)
  Top 0.559: R10.P$1 19.06,26.96 v19.05,26.97
  Top 0.813: T3.C v12.95,31.85
  Route3 0.813: v38.41,76.35 38.1,76.66 14.33,76.66 9.3,71.63 9.3,53.49 12.95,49.83 v12.95,31.85
  Route3 1.016: v19.05,26.97 16.31,29.72 12.5,29.72 11.43,30.78 11.43,49.23 7.62,53.04 7.62,72.39 13.56,78.33 35.66,78.33 v38.56,81.23 37.49,80.16 12.8,80.16 5.79,73.15 5.79,68.28 3.91,66.4 JP4.1
  pour Top (rank 5, no thermals): 16.76,87.02 73.91,87.02 73.91,71.02 16.76,71.02
OUT_SET  (via drill 0.33)
  Top 0.406: 14.21,64.41 C22.P$1 14.33,64.3 14.33,64.01 | v61.72,63.7 59.65,63.7 REG1.2 | 57.61,64.01 57.61,64.22 C21.P$1
  Top 0.559: v68.43,17.83 R12.P$2 68.29,16.75 68.27,16.76 R15.1
  Top 0.61: JP3.1 67.82,21.03 68.43,20.42 v68.43,17.83 | D1.1 v49.07,66.45
  Top 0.813: 14.33,64.01 14.53,63.8 REG2.2 18.39,63.8 v18.44,63.86 | REG1.2 59.52,63.78 57.84,63.78 57.61,64.01
  Route3 0.406: v18.44,63.86 18.44,68.88 19.96,70.41 47.85,70.41 49.07,69.19 v49.07,66.45 49.07,65.38 49.38,65.07 55.78,65.07 56.69,64.16 61.27,64.16 v61.72,63.7
  Route3 0.61: v68.43,17.83 73,17.83 75.13,19.96 75.13,23.32 76.66,24.84 VR1.P$2 VR1.P$1 | JP1.2 64.41,32.72 66.29,34.59 85.65,34.59 87.33,36.27 87.33,69.04 86.56,69.8 64.31,69.8 61.72,67.21 v61.72,63.7
  Bottom 0.61: JP1.2 JP2.2 JP3.2 JP3.1
PG
  Top 0.254: U1.23 29.19,25.83 28.19,26.82 R4.P$1
Q1_GATE
  Top 0.406: R9.P$1 22.4,25.82 Q1.1 22.33,25.76 R10.P$2
Q2_GATE
  Top 0.559: R28.P$2 10.61,20.1 Q2.1
RT
  Top 0.254: U1.3 29.69,19.32 29.26,18.9 R3.P$2
RUN
  Top 0.254: Q2.3 11.73,23.01 11.43,23.32 10.06,23.32 9.74,23.63 U2.5 9.28,23.59 R26.P$2
SW_BOOST
  pour Top (no thermals): 31.17,25.07 31.17,25.98 32,26.82 32,35.81 38.86,35.81 38.86,25.07
SW_NEG
  pour Top (no thermals): 6.25,25.07 6.25,26.21 4.11,26.21 4.11,28.8 6.78,28.8 6.78,25.07
TEMP1  (via drill 0.51)
  Top 0.406: R16.P$2 57.61,59.97
  Top 0.559: REG1.5 61.67,59.99 v61.72,60.05
  Top 0.813: 57.61,59.97 59.52,59.97 REG1.5
  Bottom 0.559: JP4.5 4.27,56.24 5.33,55.17 5.33,43.59 8.38,40.54 45.11,40.54 46.33,41.76 46.33,56.08 48.77,58.52 61.27,58.52 61.72,58.98 v61.72,60.05
TEMP2
  Top 0.406: 14.19,59.99 R17.P$2 14.4,59.97
  Top 0.559: 14.19,59.99 14.19,59.6 13.26,58.67 2.23,58.67
  Top 0.61: 2.23,58.67 JP4.4
  Top 0.813: REG2.5 14.43,59.99 14.4,59.97
TR/SS
  Top 0.254: U1.2 29.19,20.97 C4.P$1
VIN  (via drill 5.08 pad 7.62)
  Top 0.254: U2.2 5.69,24.63 5.64,24.69
  Top 0.406: 58.22,10.67 R6.P$2
  Top 0.559: v23.77,5.79 23.77,9.45 17.22,16 5.64,16 4.15,17.49 C24.1 4.88,25.15 5.33,24.69 5.64,24.69
  Top 0.61: v23.77,5.79 28.5,0.76 53.03,0.76 58.22,5.94 58.22,10.67
  Bottom 1.016: JP4.6 2.13,49.68 1.07,48.62 1.07,3.66 3.81,0.91 18.9,0.91 v23.77,5.79
  pour Top (no thermals): 30.63,22.78 30.63,21.18 31.09,20.73 31.09,13.87 19.51,13.87 19.51,0.3 33.07,0.3 33.07,21.34 32.38,21.34 31.78,21.95 31.78,22.78
  pour Top (no thermals): 57.76,11.13 60.35,11.13 60.35,10.21 57.76,10.21
VOUT_SET
  Top 0.254: U3.4 68.11,14.62 68.43,14.94 R12.P$1
  Top 0.406: R12.P$1 69.66,15.25 71.01,16.6 R14.P$1 R13.P$1

### Text on the board
tPlace: PSU | OUT | GND | 0V - 24V | 0A - 3A | OUT | GND | IMON | TEMP2 | TEMP1 | VIN | V | 5V | 15V | 24V | VOUT MAX | I | VIN | GND